# Altium project gps with esp32-c6.PrjPcb
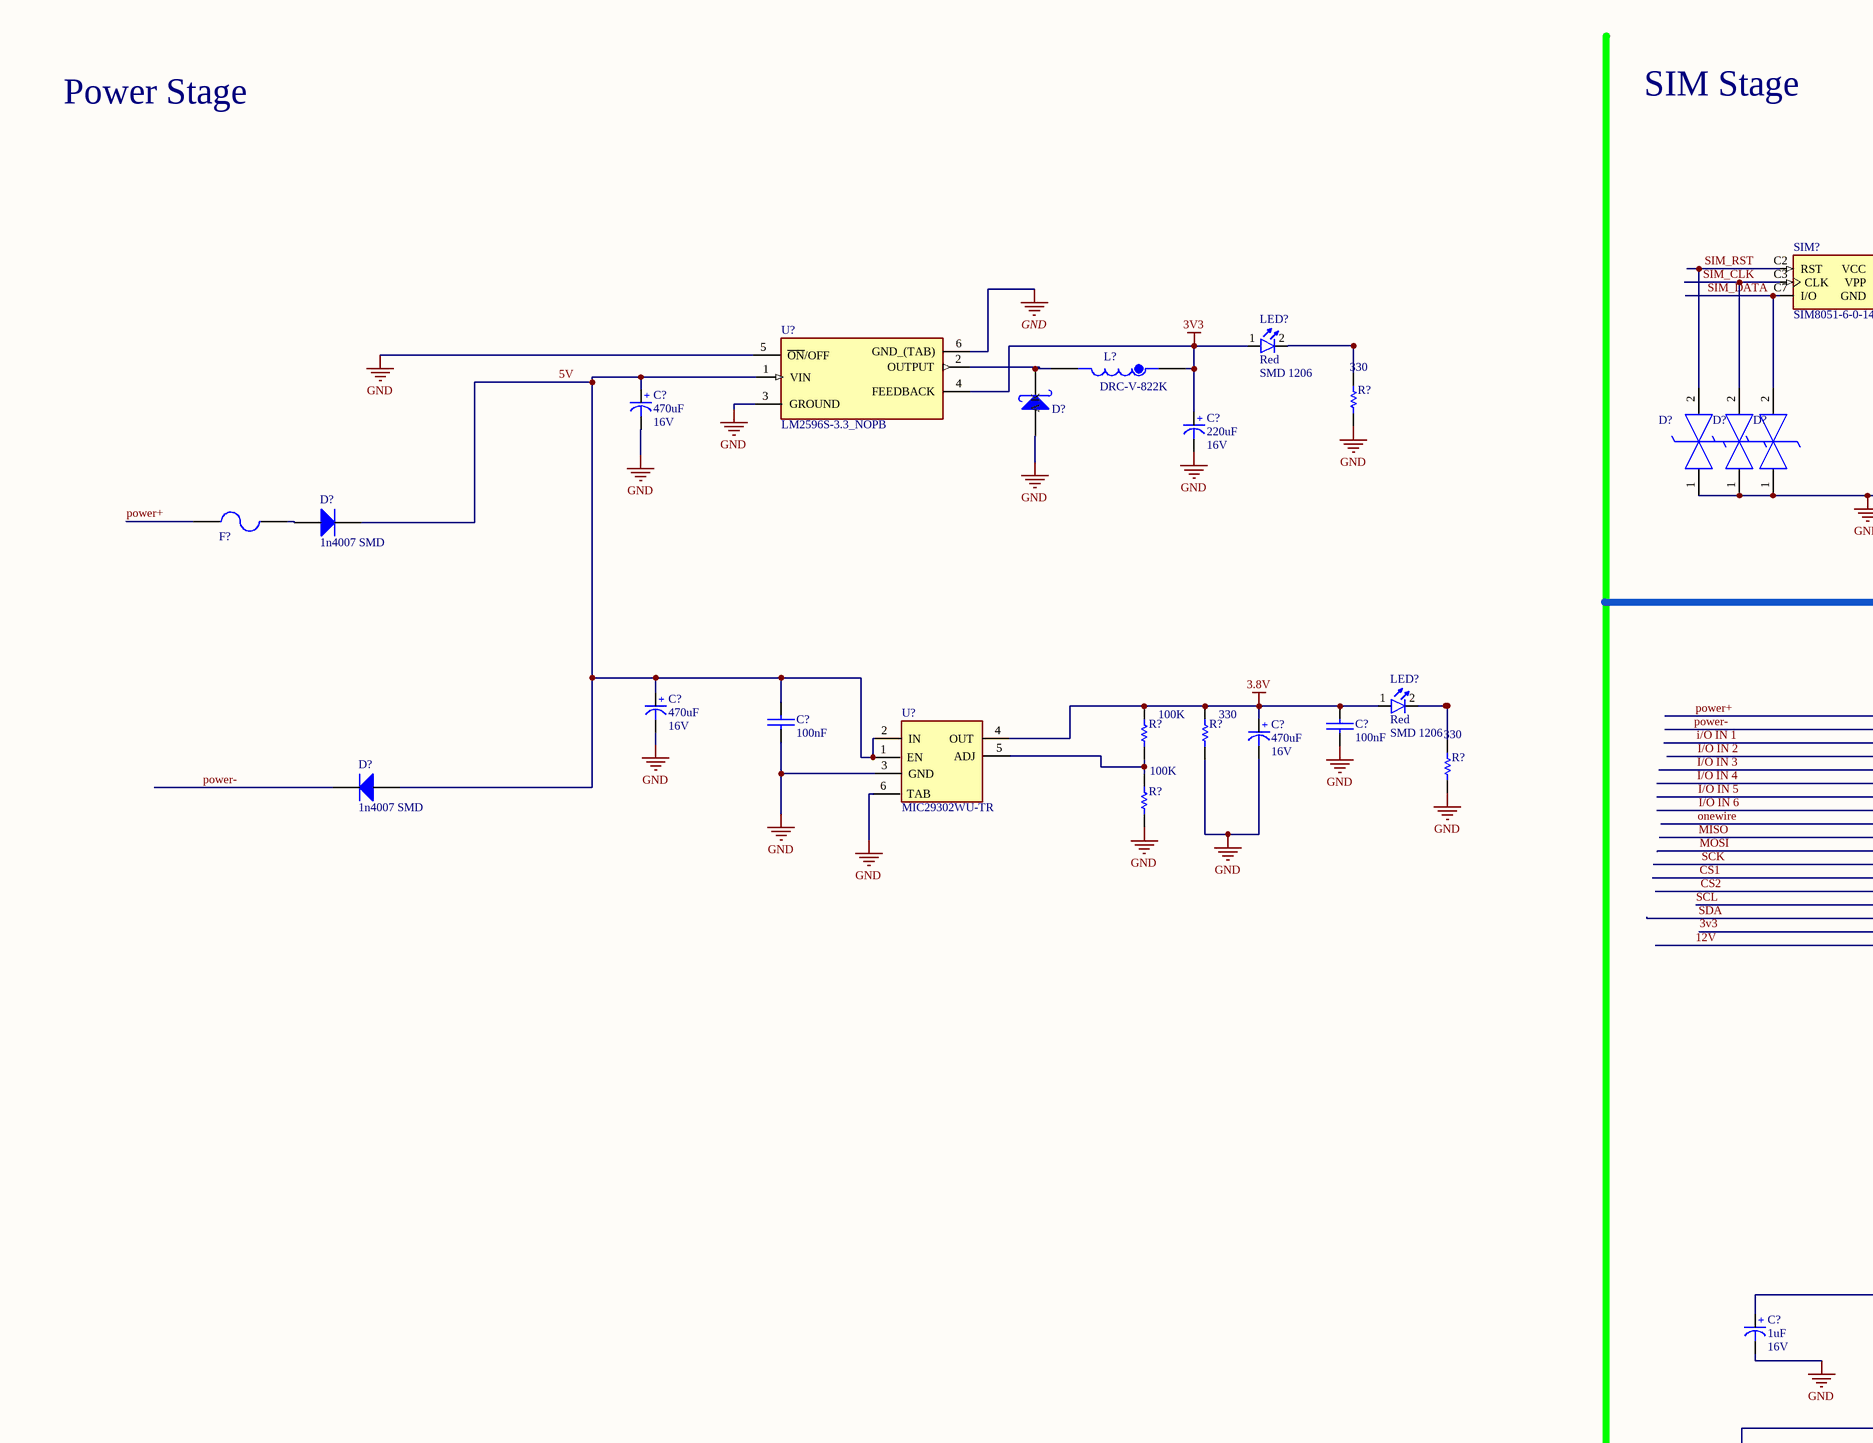
[diagram p0: main board.SchDoc, top left]
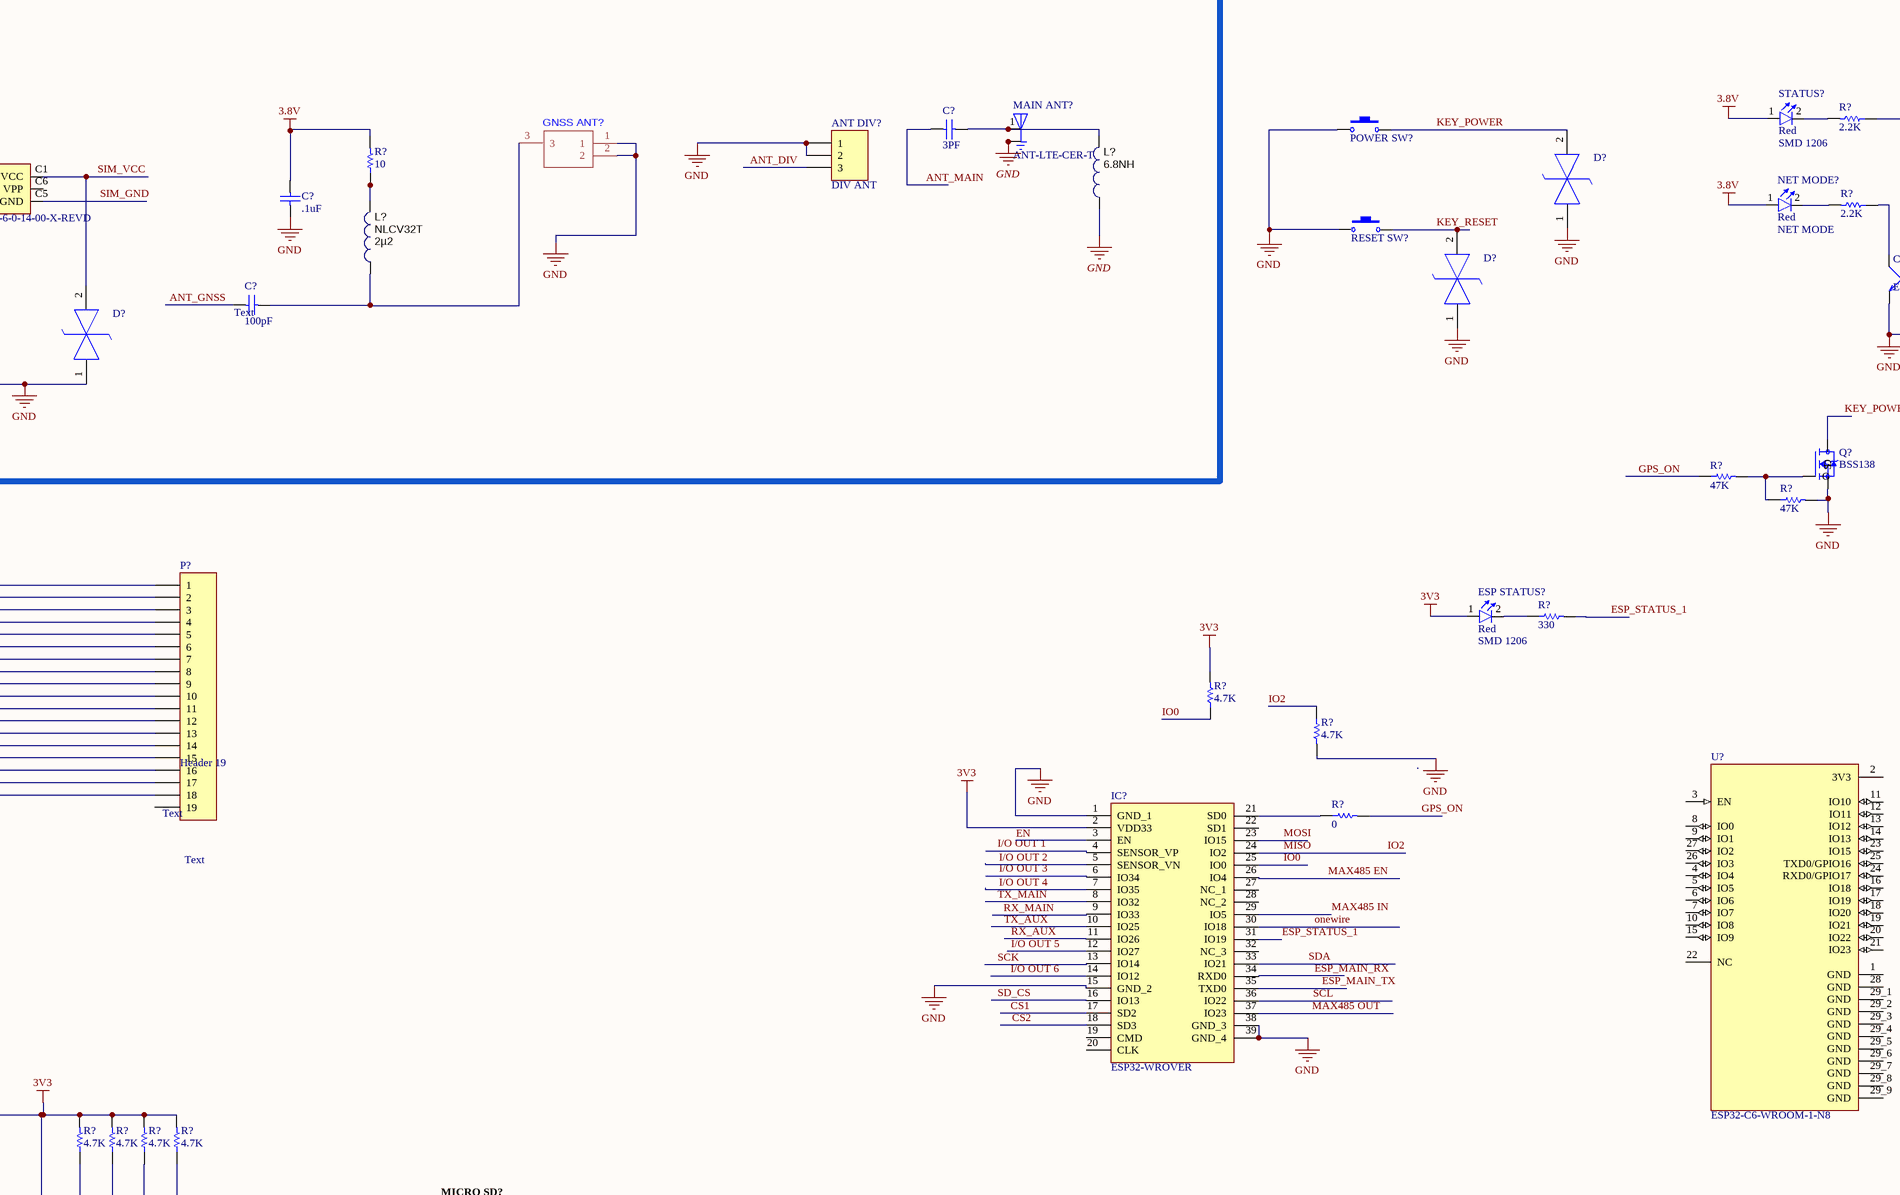
[diagram p1: main board.SchDoc, top middle]
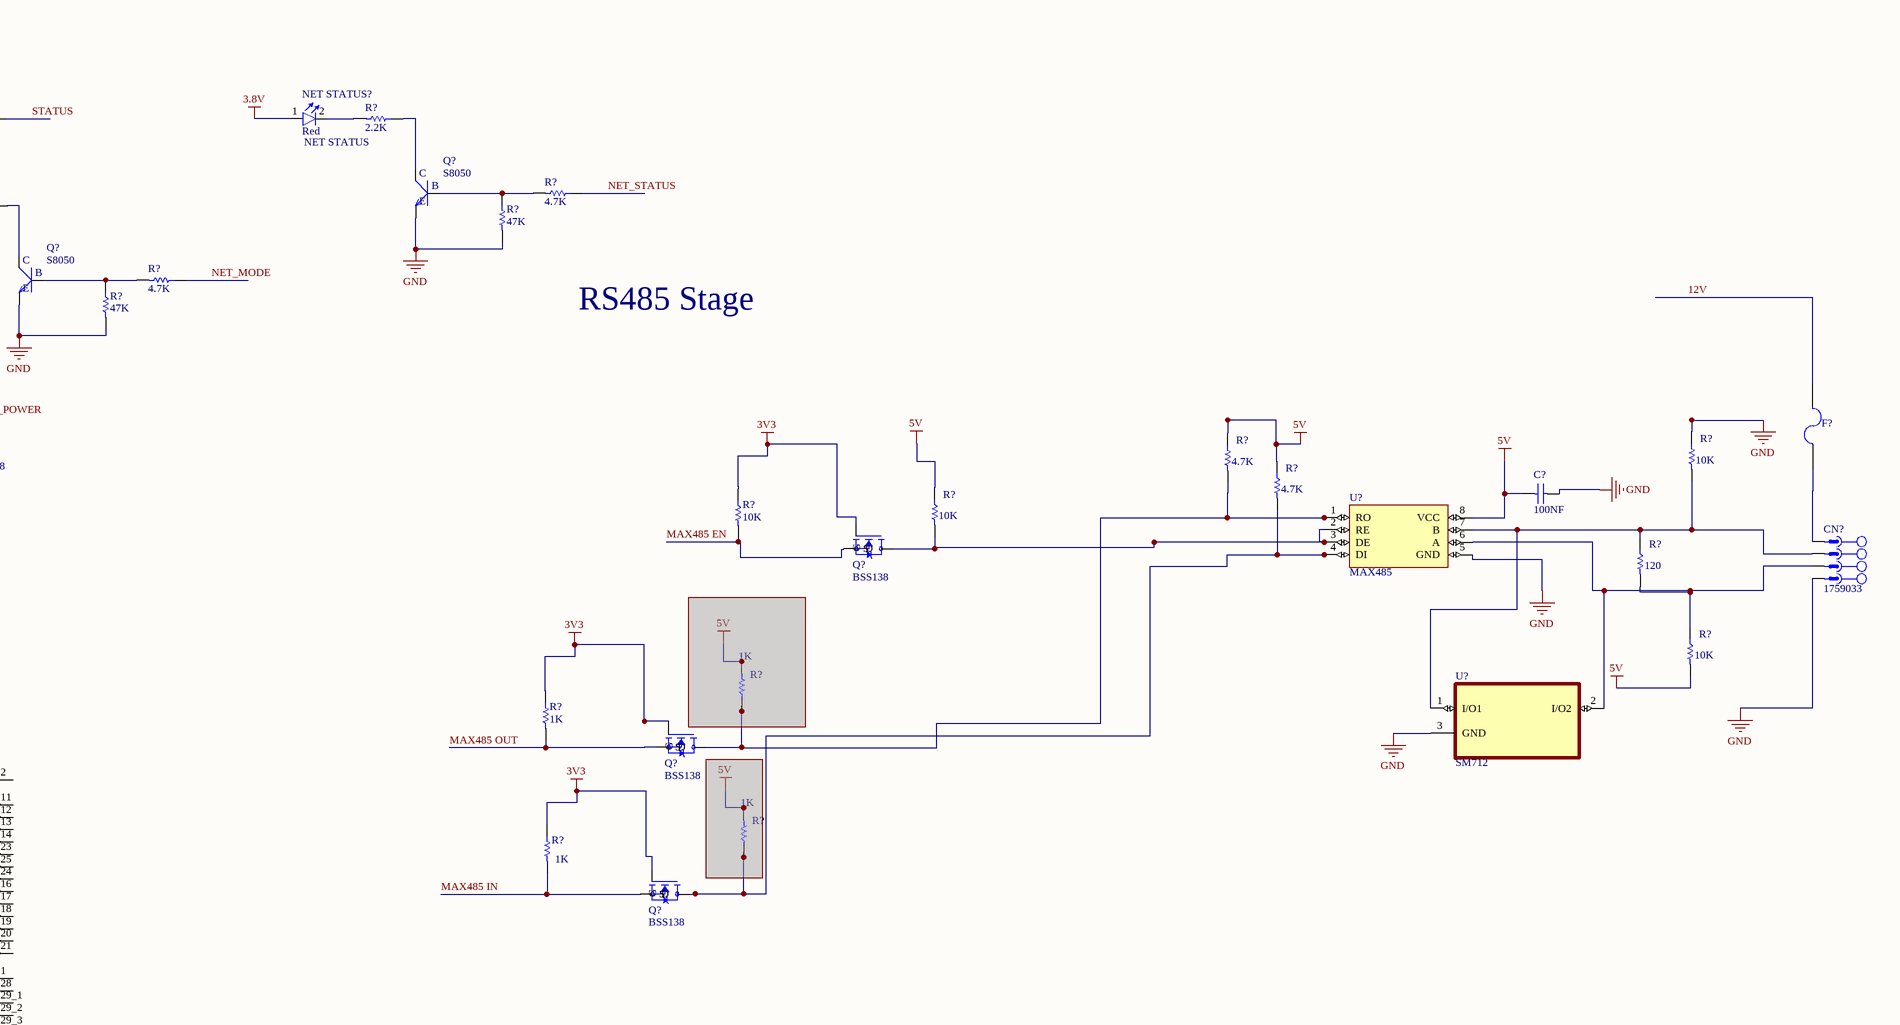
[diagram p2: main board.SchDoc, top right]
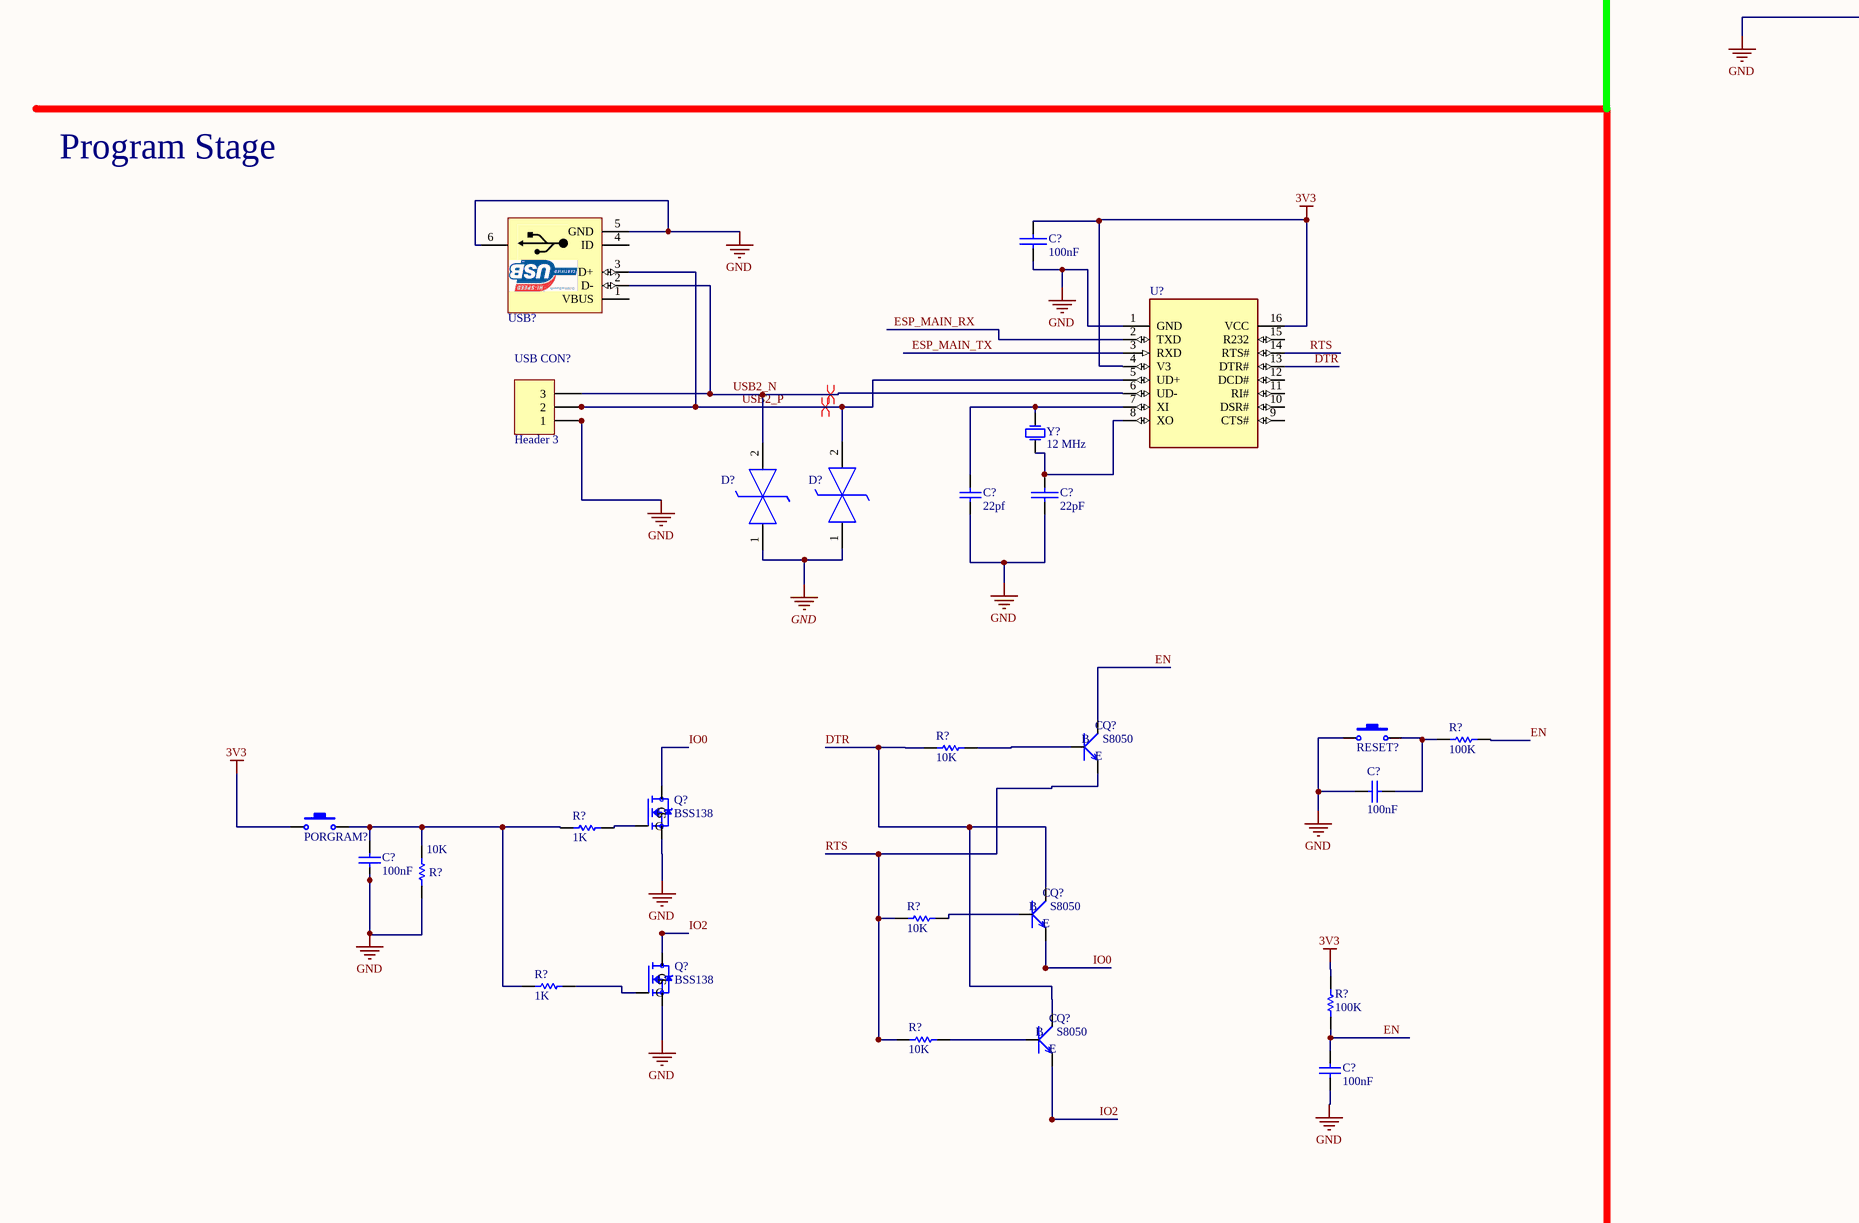
[diagram p3: main board.SchDoc, centre left]
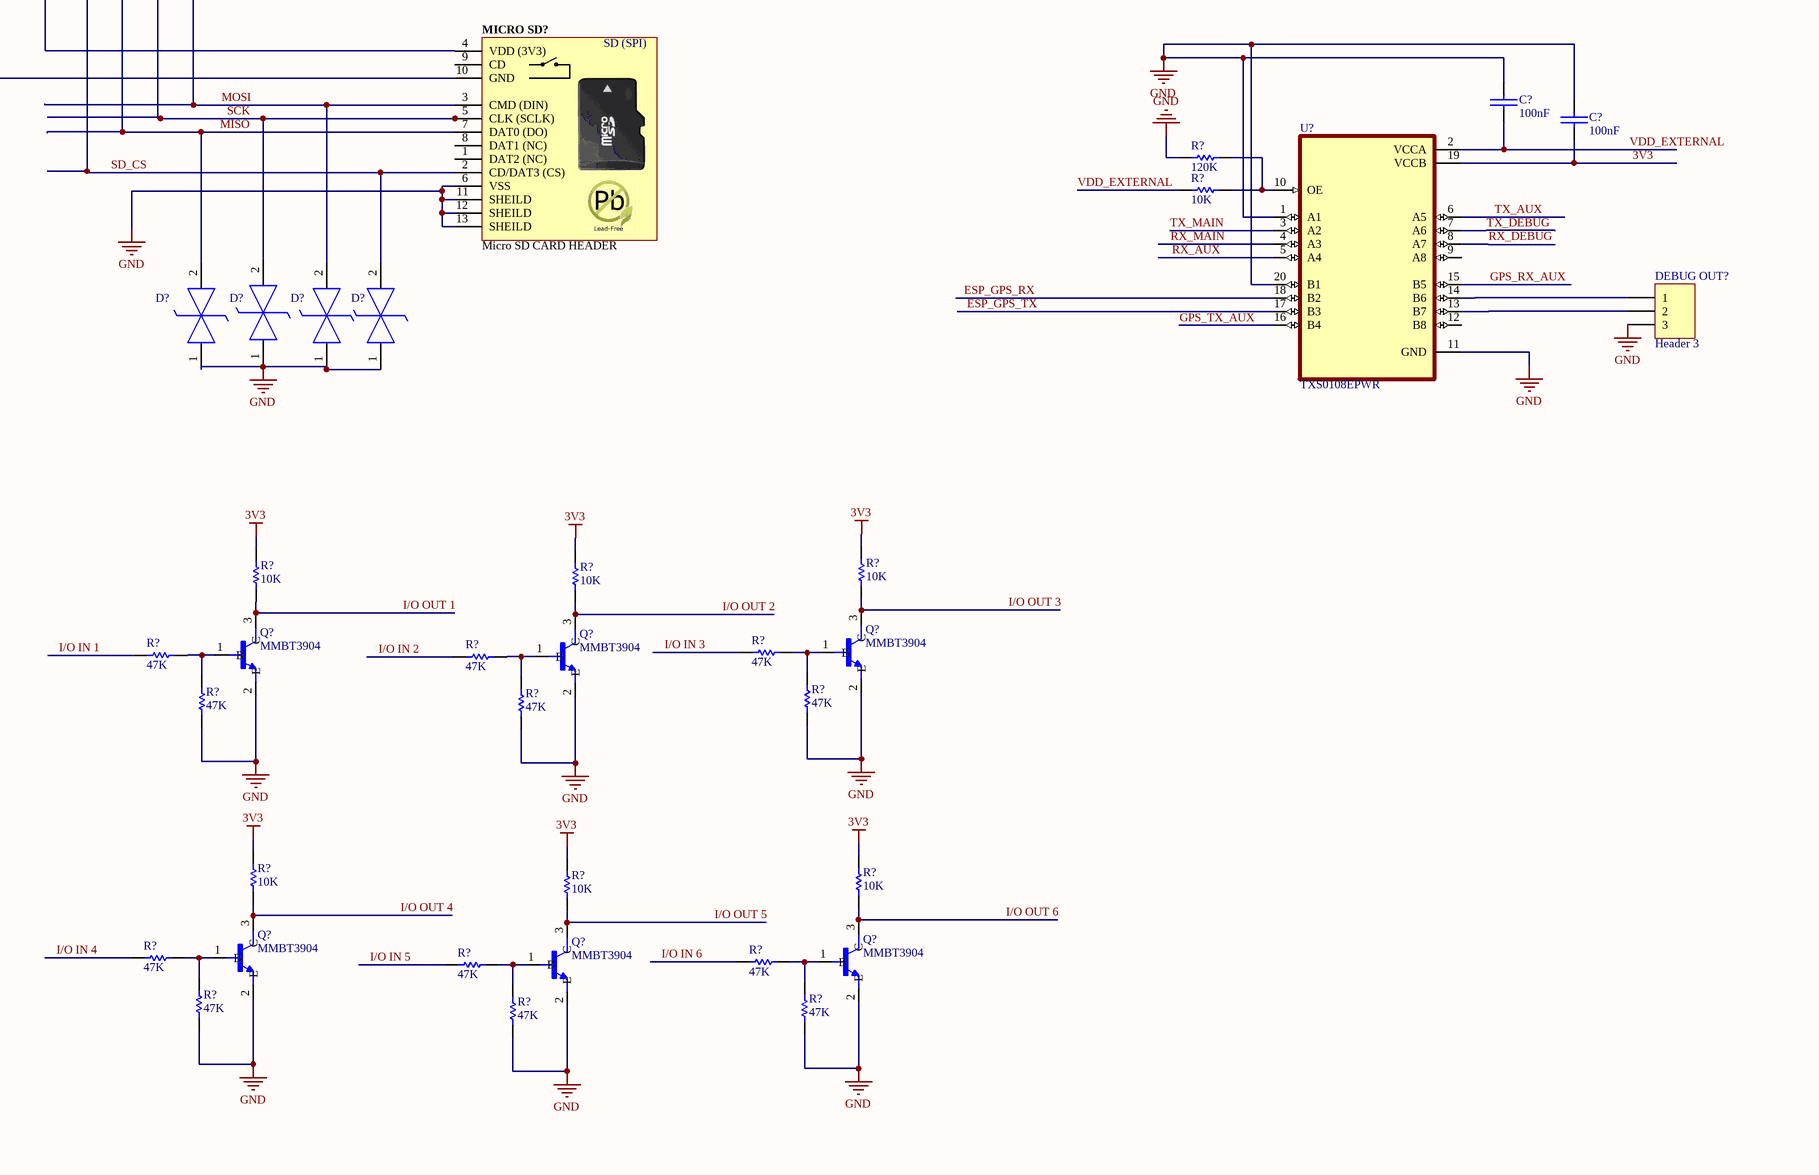
[diagram p4: main board.SchDoc, centre middle]
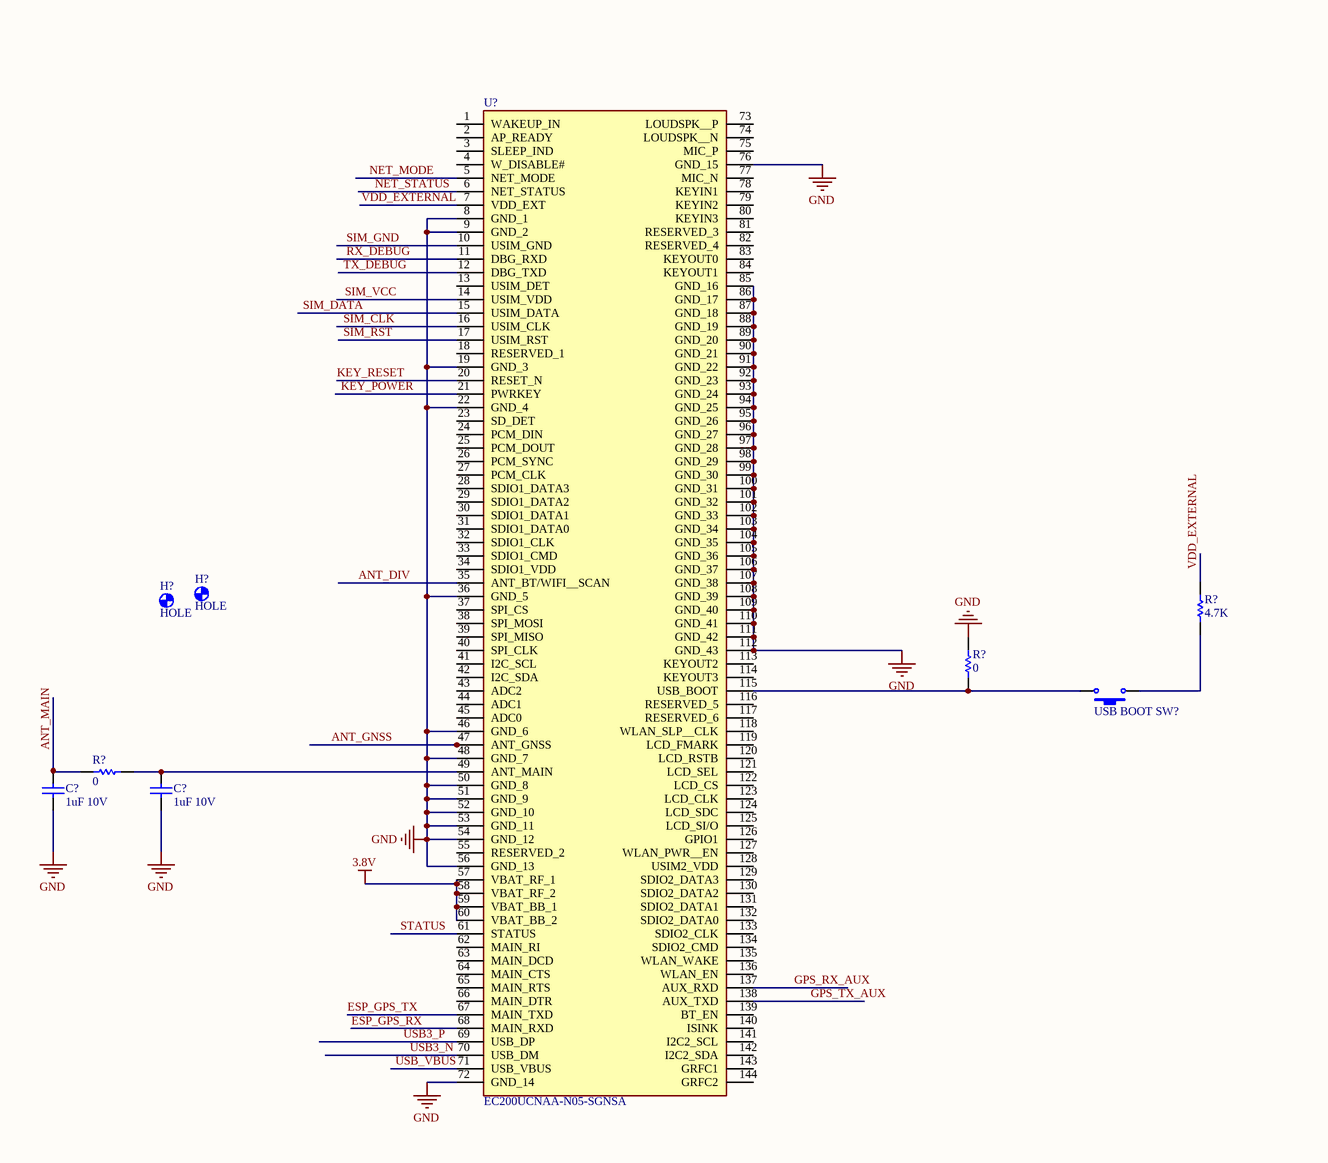
[diagram p5: main board.SchDoc, centre right]
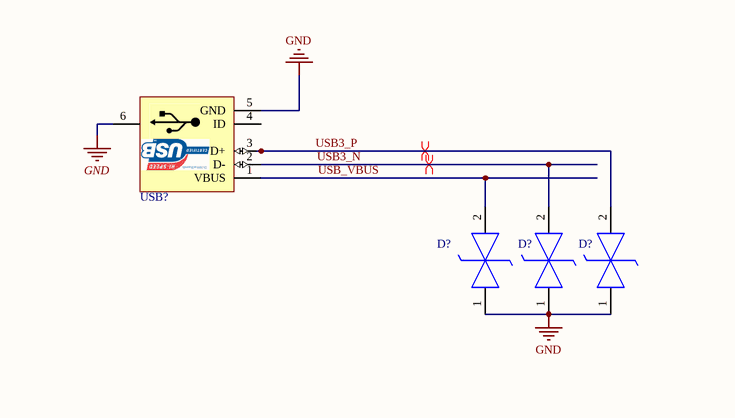
[diagram p6: main board.SchDoc, bottom middle]
1 sheet, 160 parts. Net scope: global (net labels, ports and power ports of the same name join across sheets).

## Sheet main board.SchDoc
size A0; SheetNumber: 1; SheetTotal: 1

### Parts
(Parts that share a designator on the sheet are numbered #1, #2 ... from top to bottom, then left to right.)
ANT_DIV?  DIV ANT  [HDR1X3]
C?#1  3PF  [CAPC2012X140N]
C?#2  .1uF  [CAPC2012X140N]
C?#3  Voltage: 16V  [CAP_EEEFN1C471P]  (hidden comment: 470uF)
C?#4  100pF  [CAPC2012X140N]
C?#5  Voltage: 16V  [CAP_EEEFT1C221AL]  (hidden comment: 220uF)
C?#6  100NF  [CAPC2012X140N]
C?#7  Voltage: 16V  [CAP_EEEFN1C471P]  (hidden comment: 470uF)
C?#8  100nF  [CAPC2012X140N]
C?#9  Voltage: 16V  [CAP_EEEFN1C471P]  (hidden comment: 470uF)
C?#10  100nF  [CAPC2012X140N]
C?#11  Voltage: 16V  [CAP_EEEFN1H100UR]  (hidden comment: 1uF)
C?#12  100nF  [CAPC2012X140N]
C?#13  100nF  [CAPC2012X140N]
C?#14  100nF  [CAPC2012X140N]
C?#15  22pf  [CAPC2012X140N]
C?#16  22pF  [CAPC2012X140N]
C?#17  100nF  [CAPC2012X140N]
C?#18  100nF  [CAPC2012X140N]
C?#19  100nF  [CAPC2012X140N]
C?#20  1uF 10V  [CAPC2012X140N]
C?#21  1uF 10V  [CAPC2012X140N]
CN?  1759033  [PCBComponent_1]
D?#1  PESD5V0S1BL,315  [DIO_PESD5V0S1UL,315]  (value not drawn)
D?#2  1n5822  [PCBComponent_1]  (value not drawn)
D?#3  PESD5V0S1BL,315  [DIO_PESD5V0S1UL,315]  (value not drawn)
D?#4  PESD5V0S1BL,315  [DIO_PESD5V0S1UL,315]  (value not drawn)
D?#5  PESD5V0S1BL,315  [DIO_PESD5V0S1UL,315]  (value not drawn)
D?#6  PESD5V0S1BL,315  [DIO_PESD5V0S1UL,315]  (value not drawn)
D?#7  PESD5V0S1BL,315  [DIO_PESD5V0S1UL,315]  (value not drawn)
D?#8  1n4007 SMD  [PCBComponent_1]
D?#9  1n4007 SMD  [PCBComponent_1]
D?#10  PESD5V0S1BL,315  [DIO_PESD5V0S1UL,315]  (value not drawn)
D?#11  PESD5V0S1BL,315  [DIO_PESD5V0S1UL,315]  (value not drawn)
D?#12  PESD5V0S1BL,315  [DIO_PESD5V0S1UL,315]  (value not drawn)
D?#13  PESD5V0S1BL,315  [DIO_PESD5V0S1UL,315]  (value not drawn)
D?#14  PESD5V0S1BL,315  [DIO_PESD5V0S1UL,315]  (value not drawn)
D?#15  PESD5V0S1BL,315  [DIO_PESD5V0S1UL,315]  (value not drawn)
D?#16  PESD5V0S1BL,315  [DIO_PESD5V0S1UL,315]  (value not drawn)
D?#17  PESD5V0S1BL,315  [DIO_PESD5V0S1UL,315]  (value not drawn)
D?#18  PESD5V0S1BL,315  [DIO_PESD5V0S1UL,315]  (value not drawn)
DEBUG_OUT?  Header 3  [TE_826926-3]
ESP_STATUS?  Size: SMD 1206  [PCBComponent_1]  (hidden comment: Red)
F?#1  F=1.0 A  [RESC3216X125N]  (value not drawn)
F?#2  F=4A  [RESC3216X125N]  (value not drawn)
GNSS_ANT?  U.FL-R-SMT-1_01_  [PCBComponent_1]  (value not drawn)
H?#1  HOLE  [P3.0]  (no BOM)
H?#2  HOLE  [P3.0]  (no BOM)
IC?  ESP32-WROVER  [XCVR_ESP32-WROVER-I]
L?#1  6.8NH  [INDM3225X240N]
L?#2  NLCV32T  value 2µ2  [INDM3225X240N]
L?#3  DRC-V-822K  [IND_DRC-V-821K]
LED?#1  Size: SMD 1206  [PCBComponent_1]  (hidden comment: Red)
LED?#2  Size: SMD 1206  [PCBComponent_1]  (hidden comment: Red)
MAIN_ANT?  ANT-LTE-CER-T  [XDCR_ANT-LTE-CER-T]
MICRO_SD?  Micro SD CARD HEADER  [AMPHENOL_GTFP08131Y2HR]
NET_MODE?  Size: NET MODE  [PCBComponent_1]  (hidden comment: Red)
NET_STATUS?  Size: NET STATUS  [PCBComponent_1]  (hidden comment: Red)
P?  Header 19  [HDR1X19]
PORGRAM?  Switch PB  [PCBComponent_1]  (value not drawn)
POWER_SW?  Switch PB  [PCBComponent_1]  (value not drawn)
Q?#1  S8050  [TRANS_SS8050-G]
Q?#2  S8050  [TRANS_SS8050-G]
Q?#3  BSS138  [SOT-23-3_L2.9-W1.3-P1.90-LS2.4-BR]
Q?#4  BSS138  [SOT-23-3_L2.9-W1.3-P1.90-LS2.4-BR]
Q?#5  BSS138  [SOT-23-3_L2.9-W1.3-P1.90-LS2.4-BR]
Q?#6  BSS138  [SOT-23-3_L2.9-W1.3-P1.90-LS2.4-BR]
Q?#7  MMBT3904  [SOT95P240X120-3N]
Q?#8  MMBT3904  [SOT95P240X120-3N]
Q?#9  MMBT3904  [SOT95P240X120-3N]
Q?#10  S8050  [TRANS_SS8050-G]
Q?#11  BSS138  [SOT-23-3_L2.9-W1.3-P1.90-LS2.4-BR]
Q?#12  MMBT3904  [SOT95P240X120-3N]
Q?#13  MMBT3904  [SOT95P240X120-3N]
Q?#14  MMBT3904  [SOT95P240X120-3N]
Q?#15  S8050  [TRANS_SS8050-G]
Q?#16  BSS138  [SOT-23-3_L2.9-W1.3-P1.90-LS2.4-BR]
Q?#17  S8050  [TRANS_SS8050-G]
R?#1  2.2K  [RESC2012X65N]
R?#2  2.2K  [RESC2012X65N]
R?#3  10  [RESC2012X65N]
R?#4  4.7K  [RESC2012X65N]
R?#5  2.2K  [RESC2012X65N]
R?#6  47K  [RESC2012X65N]
R?#7  4.7K  [RESC2012X65N]
R?#8  330  [RESC2012X65N]
R?#9  47K  [RESC2012X65N]
R?#10  4.7K  [RESC2012X65N]
R?#11  10K  [RESC2012X65N]
R?#12  47K  [RESC2012X65N]
R?#13  4.7K  [RESC2012X65N]
R?#14  47K  [RESC2012X65N]
R?#15  10K  [RESC2012X65N]
R?#16  10K  [RESC2012X65N]
R?#17  120  [RESC2012X65N]
R?#18  100K  [RESC2012X65N]
R?#19  330  [RESC2012X65N]
R?#20  330  [RESC2012X65N]
R?#21  330  [RESC2012X65N]
R?#22  10K  [RESC2012X65N]
R?#23  100K  [RESC2012X65N]
R?#24  1K  [1206]  (masked out: inside a compile mask, not in the netlist)
R?#25  4.7K  [RESC2012X65N]
R?#26  1K  [RESC2012X65N]
R?#27  4.7K  [RESC2012X65N]
R?#28  0  [RESC2012X65N]
R?#29  1K  [1206]  (masked out: inside a compile mask, not in the netlist)
R?#30  1K  [RESC2012X65N]
R?#31  4.7K  [RESC2012X65N]
R?#32  4.7K  [RESC2012X65N]
R?#33  4.7K  [RESC2012X65N]
R?#34  4.7K  [RESC2012X65N]
R?#35  120K  [RESC2012X65N]
R?#36  10K  [RESC2012X65N]
R?#37  10K  [RESC2012X65N]
R?#38  10K  [RESC2012X65N]
R?#39  10K  [RESC2012X65N]
R?#40  47K  [RESC2012X65N]
R?#41  47K  [RESC2012X65N]
R?#42  47K  [RESC2012X65N]
R?#43  47K  [RESC2012X65N]
R?#44  47K  [RESC2012X65N]
R?#45  47K  [RESC2012X65N]
R?#46  100K  [RESC2012X65N]
R?#47  10K  [RESC2012X65N]
R?#48  10K  [RESC2012X65N]
R?#49  10K  [RESC2012X65N]
R?#50  10K  [RESC2012X65N]
R?#51  1K  [RESC2012X65N]
R?#52  10K  [RESC2012X65N]
R?#53  47K  [RESC2012X65N]
R?#54  47K  [RESC2012X65N]
R?#55  47K  [RESC2012X65N]
R?#56  4.7K  [RESC2012X65N]
R?#57  10K  [RESC2012X65N]
R?#58  47K  [RESC2012X65N]
R?#59  47K  [RESC2012X65N]
R?#60  47K  [RESC2012X65N]
R?#61  0  [RESC2012X65N]
R?#62  1K  [RESC2012X65N]
R?#63  100K  [RESC2012X65N]
R?#64  10K  [RESC2012X65N]
R?#65  0  [RESC2012X65N]
RESET?  Switch PB  [PCBComponent_1]  (value not drawn)
RESET_SW?  Switch PB  [PCBComponent_1]  (value not drawn)
SIM?  SIM8051-6-0-14-00-X-REVD  [PCBComponent_1]
STATUS?  Size: SMD 1206  [PCBComponent_1]  (hidden comment: Red)
U?#1  LM2596S-3.3_NOPB  [TO170P1435X465-6N]
U?#2  MAX485  [SOIC127P600X175-8N]
U?#3  MIC29302WU-TR  [MIC29302WUTR]
U?#4  SM712  [SOT23]
U?#5  ESP32-C6-WROOM-1-N8  [XCVR_ESP32-C6-WROOM-1-N8]
U?#6  TXS0108EPWR  [SOP65P640X120-20N]
U?#7  (no value)  [SO16_M]
U?#8  EC200UCNAA-N05-SGNSA  [EC200UCNAAN05SGNSA]
USB?#1  USB Connector  [USB_AB_BM_SHS]  (value not drawn)
USB?#2  USB Connector  [USB_AB_BM_SHS]  (value not drawn)
USB_BOOT_SW?  Switch PB  [PCBComponent_1]  (value not drawn)
USB_CON?  Header 3  [HDR1X3]
Y?  12 MHz  [PCBComponent_1]

### Nets
3.8V: C?#2.2 C?#9.1(+) C?#10.2(-) LED?#2.1(A) NET_MODE?.1(A) NET_STATUS?.1(A) R?#3.2 R?#18.2 R?#19.2 STATUS?.1(A) U?#3.4(OUT) U?#8.57(VBAT_RF_1) U?#8.58(VBAT_RF_2) U?#8.59(VBAT_BB_1) U?#8.60(VBAT_BB_2)
3V3: C?#5.1(+) C?#11.1(+) C?#13.2(-) C?#14.2(-) ESP_STATUS?.1(A) IC?.2(VDD33) L?#3.1 LED?#1.1(A) MICRO_SD?.4(VDD_(3V3)) P?.17 PORGRAM?.1 Q?#4.1(G) Q?#5.1(G) Q?#6.1(G) R?#15.1 R?#25.2 R?#26.1 R?#30.1 R?#31.2 R?#32.2 R?#33.2 R?#34.2 R?#37.2 R?#38.2 R?#39.2 R?#48.2 R?#49.2 R?#50.2 R?#63.1 U?#1.4(FEEDBACK) U?#6.19(VCCB) U?#7.4(V3) U?#7.16(VCC)
5V: C?#3.1(+) C?#6.2 C?#7.1(+) C?#8.2(-) D?#8.2(K) D?#9.1(A) R?#10.1 R?#13.1 R?#16.1 R?#22.2 U?#1.1(VIN) U?#2.8(VCC) U?#3.1(EN) U?#3.2(IN)
GND: ANT_DIV?.1 ANT_DIV?.2 C?#2.1 C?#3.2(-) C?#5.2(-) C?#6.1 C?#7.2(-) C?#8.1(+) C?#9.2(-) C?#10.1(+) C?#11.2(-) C?#12.1(+) C?#13.1(+) C?#14.1(+) C?#15.2(-) C?#16.1(+) C?#17.1(+) C?#18.2(-) C?#19.2(-) C?#20.1 C?#21.1 CN?.4 D?#1.1(K1) D?#2.K D?#3.1(K1) D?#4.1(K1) D?#5.1(K1) D?#6.1(K1) D?#7.1(K1) D?#10.1(K1) D?#11.1(K1) D?#12.1(K1) D?#13.1(K1) D?#14.1(K1) D?#15.1(K1) D?#16.1(K1) D?#17.1(K1) D?#18.1(K1) DEBUG_OUT?.3 GNSS_ANT?.1 GNSS_ANT?.2 IC?.1(GND_1) IC?.15(GND_2) IC?.38(GND_3) IC?.39(GND_4) L?#1.1 MAIN_ANT?.2(GND) MAIN_ANT?.3(GND) MICRO_SD?.6(VSS) MICRO_SD?.10(GND) MICRO_SD?.11(SHEILD) MICRO_SD?.12(SHEILD) MICRO_SD?.13(SHEILD) POWER_SW?.1 Q?#1.2(E) Q?#2.2(E) Q?#3.2(S) Q?#7.2(E) Q?#8.2(E) Q?#9.2(E) Q?#11.2(S) Q?#12.2(E) Q?#13.2(E) Q?#14.2(E) Q?#16.2(S) R?#6.2 R?#8.1 R?#9.2 R?#11.1 R?#14.2 R?#19.1 R?#21.1 R?#23.1 R?#27.2 R?#35.2 R?#43.1 R?#44.1 R?#45.1 R?#52.1 R?#58.1 R?#59.1 R?#60.1 R?#61.1 RESET?.1 RESET_SW?.1 U?#1.3(GROUND) U?#1.5(~{ON}/OFF) U?#1.6(GND_(TAB)) U?#2.5(GND) U?#3.3(GND) U?#3.6(TAB) U?#4.3(GND) U?#6.1(A1) U?#6.11(GND) U?#6.20(B1) U?#7.1(GND) U?#8.8(GND_1) U?#8.9(GND_2) U?#8.19(GND_3) U?#8.22(GND_4) U?#8.36(GND_5) U?#8.46(GND_6) U?#8.48(GND_7) U?#8.50(GND_8) U?#8.51(GND_9) U?#8.52(GND_10) U?#8.53(GND_11) U?#8.54(GND_12) U?#8.56(GND_13) U?#8.72(GND_14) U?#8.76(GND_15) U?#8.85(GND_16) U?#8.86(GND_17) U?#8.87(GND_18) U?#8.88(GND_19) U?#8.89(GND_20) U?#8.90(GND_21) U?#8.91(GND_22) U?#8.92(GND_23) U?#8.93(GND_24) U?#8.94(GND_25) U?#8.95(GND_26) U?#8.96(GND_27) U?#8.97(GND_28) U?#8.98(GND_29) U?#8.99(GND_30) U?#8.100(GND_31) U?#8.101(GND_32) U?#8.102(GND_33) U?#8.103(GND_34) U?#8.104(GND_35) U?#8.105(GND_36) U?#8.106(GND_37) U?#8.107(GND_38) U?#8.108(GND_39) U?#8.109(GND_40) U?#8.110(GND_41) U?#8.111(GND_42) U?#8.112(GND_43) USB?#1.5(GND) USB?#1.6(MH) USB?#2.5(GND) USB?#2.6(MH) USB_CON?.1
12V: F?#2.2 P?.18
ANT_DIV: ANT_DIV?.3 U?#8.35(ANT_BT/WIFI__SCAN)
ANT_GNSS: C?#4.1 U?#8.47(ANT_GNSS)
ANT_MAIN: C?#1.2 C?#20.2 R?#65.1
CS1: IC?.17(SD2) P?.13
CS2: IC?.18(SD3) P?.14
DTR: Q?#15.3(C) Q?#17.3(C) R?#47.2 U?#7.13(DTR#)
EN: C?#19.1(+) IC?.3(EN) Q?#10.3(C) R?#46.1 R?#63.2
ESP_GPS_RX: U?#6.18(B2) U?#8.68(MAIN_RXD)
ESP_GPS_TX: U?#6.17(B3) U?#8.67(MAIN_TXD)
ESP_MAIN_RX: IC?.34(RXD0) U?#7.2(TXD)
ESP_MAIN_TX: IC?.35(TXD0) U?#7.3(RXD)
ESP_STATUS_1: IC?.31(IO19) R?#20.2
GPS_ON: R?#12.1 R?#28.2
GPS_RX_AUX: U?#6.15(B5) U?#8.137(AUX_RXD)
GPS_TX_AUX: U?#6.16(B4) U?#8.138(AUX_TXD)
I/O IN 1: P?.3 R?#40.2
I/O IN 2: P?.4 R?#41.2
I/O IN 3: P?.5 R?#42.2
I/O IN 4: P?.6 R?#53.2
I/O IN 5: P?.7 R?#54.2
I/O IN 6: P?.8 R?#55.2
I/O OUT 1: IC?.4(SENSOR_VP) Q?#7.3(C) R?#37.1
I/O OUT 2: IC?.5(SENSOR_VN) Q?#8.3(C) R?#38.1
I/O OUT 3: IC?.6(IO34) Q?#9.3(C) R?#39.1
I/O OUT 4: IC?.7(IO35) Q?#12.3(C) R?#48.1
I/O OUT 5: IC?.12(IO27) Q?#13.3(C) R?#49.1
I/O OUT 6: IC?.14(IO12) Q?#14.3(C) R?#50.1
IO0: IC?.25(IO0) Q?#11.3(D) Q?#15.2(E) R?#25.1
IO2: D?#11.2(K2) IC?.24(IO2) MICRO_SD?.7(DAT0_(DO)) P?.10 Q?#16.3(D) Q?#17.2(E) R?#27.1 R?#32.1  [also labelled MISO]
KEY_POWER: D?#1.2(K2) POWER_SW?.2 Q?#3.3(D) U?#8.21(PWRKEY)
KEY_RESET: D?#3.2(K2) RESET_SW?.2 U?#8.20(RESET_N)
MAX485 EN: IC?.26(IO4) Q?#4.2(S) R?#15.2
MAX485 IN: IC?.29(IO5) Q?#6.2(S) R?#30.2
MAX485 OUT: IC?.37(IO23) Q?#5.2(S) R?#26.2
MOSI: D?#12.2(K2) IC?.23(IO15) MICRO_SD?.3(CMD_(DIN)) P?.11 R?#34.1
NET_MODE: R?#7.1 U?#8.5(NET_MODE)
NET_STATUS: R?#4.1 U?#8.6(NET_STATUS)
onewire: IC?.30(IO18) P?.9
power+: F?#1.1 P?.1
power-: D?#9.2(K) P?.2
RTS: Q?#10.2(E) R?#57.2 R?#64.2 U?#7.14(RTS#)
RX_AUX: IC?.11(IO26) U?#6.5(A4)
RX_DEBUG: U?#6.8(A7) U?#8.11(DBG_RXD)
RX_MAIN: IC?.9(IO33) U?#6.4(A3)
SCK: D?#10.2(K2) IC?.13(IO14) MICRO_SD?.5(CLK_(SCLK)) P?.12 R?#33.1
SCL: IC?.36(IO22) P?.15
SD_CS: D?#13.2(K2) IC?.16(IO13) MICRO_SD?.2(CD/DAT3_(CS)) R?#31.1
SDA: IC?.33(IO21) P?.16
SIM_CLK: D?#5.2(K2) SIM?.C3(CLK) U?#8.16(USIM_CLK)
SIM_DATA: D?#6.2(K2) SIM?.C7(I/O) U?#8.15(USIM_DATA)
SIM_GND: SIM?.C5(GND) U?#8.10(USIM_GND)
SIM_RST: D?#4.2(K2) SIM?.C2(RST) U?#8.17(USIM_RST)
SIM_VCC: D?#7.2(K2) SIM?.C1(VCC) U?#8.14(USIM_VDD)
STATUS: R?#1.1 U?#8.61(STATUS)
TX_AUX: IC?.10(IO25) U?#6.6(A5)
TX_DEBUG: U?#6.7(A6) U?#8.12(DBG_TXD)
TX_MAIN: IC?.8(IO32) U?#6.3(A2)
USB2_N: D?#15.2(K2) U?#7.6(UD-) USB?#1.2(D-) USB_CON?.3
USB2_P: D?#14.2(K2) U?#7.5(UD+) USB?#1.3(D+) USB_CON?.2
USB3_N: D?#17.2(K2) U?#8.70(USB_DM) USB?#2.2(D-)
USB3_P: D?#18.2(K2) U?#8.69(USB_DP) USB?#2.3(D+)
USB_VBUS: D?#16.2(K2) U?#8.71(USB_VBUS) USB?#2.1(VBUS)
VDD_EXTERNAL: C?#12.2(-) R?#36.2 R?#56.1 U?#6.2(VCCA) U?#8.7(VDD_EXT)
NetC?#1_1: C?#1.1 L?#1.2 MAIN_ANT?.1(FEEDING)
NetC?#4_2: C?#4.2 GNSS_ANT?.3 L?#2.1
NetC?#15_1: C?#15.1(+) U?#7.7(XI) Y?.2(OSC2)
NetC?#16_2: C?#16.2(-) U?#7.8(XO) Y?.1(OSC1)
NetC?#17_2: C?#17.2(-) R?#46.2 RESET?.2
NetC?#18_1: C?#18.1(+) PORGRAM?.2 R?#51.2 R?#52.2 R?#62.2
NetC?#21_2: C?#21.2 R?#65.2 U?#8.49(ANT_MAIN)
NetCN?_1: CN?.1 F?#2.1
NetCN?_2: CN?.2 R?#11.2 R?#17.1 U?#2.7(B) U?#4.1(I/O1)
NetCN?_3: CN?.3 R?#17.2 R?#22.1 U?#2.6(A) U?#4.2(I/O2)
NetD?#2_A: D?#2.A L?#3.2 U?#1.2(OUTPUT)
NetD?#8_1: D?#8.1(A) F?#1.2
NetDEBUG_OUT?_1: DEBUG_OUT?.1 U?#6.14(B6)
NetDEBUG_OUT?_2: DEBUG_OUT?.2 U?#6.13(B7)
NetESP_STATUS?_2: ESP_STATUS?.2(K) R?#20.1
NetIC?_21: IC?.21(SD0) R?#28.1
NetL?#2_2: L?#2.2 R?#3.1
NetLED?#1_2: LED?#1.2(K) R?#8.2
NetLED?#2_2: LED?#2.2(K) R?#21.2
NetNET_MODE?_2: NET_MODE?.2(K) R?#5.2
NetNET_STATUS?_2: NET_STATUS?.2(K) R?#2.2
NetQ?#1_1: Q?#1.1(B) R?#4.2 R?#6.1
NetQ?#1_3: Q?#1.3(C) R?#2.1
NetQ?#2_1: Q?#2.1(B) R?#7.2 R?#9.1
NetQ?#2_3: Q?#2.3(C) R?#5.1
NetQ?#3_1: Q?#3.1(G) R?#12.2 R?#14.1
NetQ?#4_3: Q?#4.3(D) R?#16.2 U?#2.2(RE) U?#2.3(DE)
NetQ?#5_3: Q?#5.3(D) R?#10.2 U?#2.1(RO)
NetQ?#6_3: Q?#6.3(D) R?#13.2 U?#2.4(DI)
NetQ?#7_1: Q?#7.1(B) R?#40.1 R?#43.2
NetQ?#8_1: Q?#8.1(B) R?#41.1 R?#44.2
NetQ?#9_1: Q?#9.1(B) R?#42.1 R?#45.2
NetQ?#10_1: Q?#10.1(B) R?#47.1
NetQ?#11_1: Q?#11.1(G) R?#51.1
NetQ?#12_1: Q?#12.1(B) R?#53.1 R?#58.2
NetQ?#13_1: Q?#13.1(B) R?#54.1 R?#60.2
NetQ?#14_1: Q?#14.1(B) R?#55.1 R?#59.2
NetQ?#15_1: Q?#15.1(B) R?#57.1
NetQ?#16_1: Q?#16.1(G) R?#62.1
NetQ?#17_1: Q?#17.1(B) R?#64.1
NetR?#1_2: R?#1.2 STATUS?.2(K)
NetR?#18_1: R?#18.1 R?#23.2 U?#3.5(ADJ)
NetR?#35_1: R?#35.1 R?#36.1 U?#6.10(OE)
NetR?#56_2: R?#56.2 USB_BOOT_SW?.1
NetR?#61_2: R?#61.2 U?#8.115(USB_BOOT) USB_BOOT_SW?.2

Not connected (* = marked no-connect by the designer): IC? 19(CMD) 20(CLK) 22(SD1) 27(NC_1) 28(NC_2) 32(NC_3); MICRO_SD? 1(DAT2_(NC)) 8(DAT1_(NC)) 9(CD); P? 19; SIM? C6(VPP); U?#5 1(GND) 2(3V3) 3(EN) 4(IO4) 5(IO5) 6(IO6) 7(IO7) 8(IO0) 9(IO1) 10(IO8) 11(IO10) 12(IO11) 13(IO12) 14(IO13) 15(IO9) 16(IO18) 17(IO19) 18(IO20) 19(IO21) 20(IO22) 21(IO23) 22(NC) 23(IO15) 24(RXD0/GPIO17) 25(TXD0/GPIO16) 26(IO3) 27(IO2) 28(GND) 29_1(GND) 29_2(GND) 29_3(GND) 29_4(GND) 29_5(GND) 29_6(GND) 29_7(GND) 29_8(GND) 29_9(GND); U?#6 9(A8) 12(B8); U?#7 9(CTS#) 10(DSR#) 11(RI#) 12(DCD#) 15(R232); U?#8 1(WAKEUP_IN) 2(AP_READY) 3(SLEEP_IND) 4(W_DISABLE#) 13(USIM_DET) 18(RESERVED_1) 23(SD_DET) 24(PCM_DIN) 25(PCM_DOUT) 26(PCM_SYNC) 27(PCM_CLK) 28(SDIO1_DATA3) 29(SDIO1_DATA2) 30(SDIO1_DATA1) 31(SDIO1_DATA0) 32(SDIO1_CLK) 33(SDIO1_CMD) 34(SDIO1_VDD) 37(SPI_CS) 38(SPI_MOSI) 39(SPI_MISO) 40(SPI_CLK) 41(I2C_SCL) 42(I2C_SDA) 43(ADC2) 44(ADC1) 45(ADC0) 55(RESERVED_2) 62(MAIN_RI) 63(MAIN_DCD) 64(MAIN_CTS) 65(MAIN_RTS) 66(MAIN_DTR) 73(LOUDSPK__P) 74(LOUDSPK__N) 75(MIC_P) 77(MIC_N) 78(KEYIN1) 79(KEYIN2) 80(KEYIN3) 81(RESERVED_3) 82(RESERVED_4) 83(KEYOUT0) 84(KEYOUT1) 113(KEYOUT2) 114(KEYOUT3) 116(RESERVED_5) 117(RESERVED_6) 118(WLAN_SLP__CLK) 119(LCD_FMARK) 120(LCD_RSTB) 121(LCD_SEL) 122(LCD_CS) 123(LCD_CLK) 124(LCD_SDC) 125(LCD_SI/O) 126(GPIO1) 127(WLAN_PWR__EN) 128(USIM2_VDD) 129(SDIO2_DATA3) 130(SDIO2_DATA2) 131(SDIO2_DATA1) 132(SDIO2_DATA0) 133(SDIO2_CLK) 134(SDIO2_CMD) 135(WLAN_WAKE) 136(WLAN_EN) 139(BT_EN) 140(ISINK) 141(I2C2_SCL) 142(I2C2_SDA) 143(GRFC1) 144(GRFC2); USB?#1 1(VBUS) 4(ID); USB?#2 4(ID)

### Layout directives
differential pair: USB2_N, USB2_P, USB3_N, USB3_P

### Notes on the sheet
- Power Stage
- SIM Stage
- (near C?#4) Text
- RS485 Stage
- (near P?) Text
- Program Stage
- (in symbol CON_Micro SD) SD (SPI)
- (in symbol USB AB MICRO CONNECTOR) D:AbbasBasereh

### Library data of the parts
ANT_DIV? DEBUG_OUT? USB_CON? = Header 3: Header, 3-Pin; LatestRevisionDate: 17-Jul-2002; LatestRevisionNote: Re-released for DXP Platform.; Publisher: Altium Limited
C?#1 C?#2 C?#4 C?#6 = CAP SMD 1206: CAP 1206; Designer: Abbas Basereh; Desc.: CAP SMD 1206; Data: 16-12-2016
C?#3 C?#5 C?#7 C?#9 C?#11 = Cap-Polar: Polar Capacitor; Designer: Saeid Jorablo; Organazation: ControTec; Adding Date: 1387/12/20
  C?#3 C?#7 C?#9: Value: 470uF
  C?#5: Value: 220uF
  C?#11: Value: 1uF
C?#8 C?#10 C?#12-C?#14 C?#16 = Cap-Bipolar: Bipolar Capacitor; Voltage: 100V; Designer: Saeid Jorablo; Organazation: ControTec; Adding Date: 1387/12/20
  C?#8 C?#10 C?#12-C?#14: Value: 100nF
  C?#16: Value: 22pF
C?#15 C?#17-C?#19 = CAP_Bipolar: Bipolar Capacitor; Voltage: 100V; Designer: Eng. Saeid Jorablo; Company: SJ Libraries; ComponentLink1Description: Datasheet; ComponentLink2Description: Reference; Publisher: SJ Unlimited; Mounting Technology: *; Mounting Technology: Surface Mount\Through-Hole; HelpURL: http://s3.picofile.com/file/7443264187/Coming_Soon_logo.gif; Status: Unreleased
  C?#15: Value: 22pf
  C?#17-C?#19: Value: 100nF
C?#20 C?#21 = CAP SMD 1206: 10 V; Designer: Abbas Basereh; Desc.: CAP SMD 1206; Data: 16-12-2016
CN? = CON_Phoenix_MSTB_04: 4 Pitch: 5.08 mm Color: green Contact surface: Tin Assembly; Manufacturer: PHOENIX CONTACT; Connector type: PCB Terminal Block; designer: ABBAS BASEREH; Max Current: 12 A; Positions: 4; Voltage: 320 V; Category: Connector; ComponentLink1Description: Header, Nominal current: 12 A Rated voltage (III/2): 320 V Number of positions: 4 Pitch: 5.08 mm Color: green Contact surface: Tin Assembly: Soldering  DESIGNER:ABBAS BASEREH; ComponentLink2Description: Reference; Mounting Technology: Through-Hole; Pin Count: 4; Revision 1: 2017-3-1; Status: Unreleased; PART.NO: 1759033
D?#1 D?#3-D?#7 D?#10-D?#18 = PESD5V0S1BL,315: Diode ESD (Bi-directional); Manufacturer_Name: Nexperia; Datasheet Link: https://assets.nexperia.com/documents/data-sheet/PESD5V0S1BL.pdf; Height: 0mm; Manufacturer_Part_Number: PESD5V0S1BL,315; Mouser Part Number: 771-PESD5V0S1BL315; Mouser Price/Stock: https://www.mouser.co.uk/ProductDetail/Nexperia/PESD5V0S1BL315?qs=LOCUfHb8d9vNKhGKXkjrvQ%3D%3D; Arrow Part Number: PESD5V0S1BL,315; Arrow Price/Stock: https://www.arrow.com/en/products/pesd5v0s1bl315/nexperia
D?#2 = 1n5822 SMD: Schottky Rectifiers; Part. No: SS34; Manufacturer: ON Semiconductor/Fairchild; Designer: Abbas Basereh; Link: https://www.aliexpress.com/item/Free-shipping-100pcs-1n5822-sma-smd-do-214ac-Schottky-diode-ss34/32337482329.html?spm=2114.01010208.3.1.zLZDsP&ws_ab_test=searchweb0_0,searchweb201602_4_10065_10068_10084_10083_10080_10082_10081_10060_10061_10062_10056_10055_10054_10059_10099_10078_10079_427_10073_10103_10102_10096_10052_10050_10051,searchweb201603_4&btsid=6e50dc92-ac69-45bc-a19e-209af19ce602; Link: http://www.tme.eu/en/details/ss34/smd-schottky-diodes/vishay/ss34-e357t/; Link: http://www.digikey.com/product-detail/en/on-semiconductor-fairchild/SS34/SS34FSCT-ND/2094459; Data: 16-12-2016
D?#8 D?#9 = DIODE_BYW98: HIGH EFFICIENCY FAST RECOVERY RECTIFIER DIODES; Designer: Eng. Saeid Jorablo; Company: SJ Libraries; IF(av): 3 A; Vrrm: 200 V; Trr (max): 35 ns; ComponentLink1Description: Datasheet; ComponentLink2Description: Reference; Publisher: SJ Unlimited; Mounting Technology: Surface Mount\Through-Hole; HelpURL: http://s3.picofile.com/file/7443264187/Coming_Soon_logo.gif; Status: Unreleased
ESP_STATUS? LED?#1 LED?#2 NET_MODE? NET_STATUS? STATUS? = LED: 5V OK; Designer: Saeid Jorablo; Organazation: ControTec; Adding Date: 1387/12/22; Color: Red
F?#1 F?#2 = Fuse 5x20 with holdeer pins: Fuses 5x20; Designer: Abbas Basereh; Desc.: fuse with holder pins 5x20; Data: 28-12-2016
H?#1 H?#2 = MOUNT-HOLE: MOUNTING HOLE with drill center marker
IC? = ESP32-WROVER: Integrated Circuit; Manufacturer_Name: Espressif Systems; Datasheet Link: https://www.mouser.it/datasheet/2/891/esp32-wrover_datasheet_en-1223875.pdf; Height: 3mm; Manufacturer_Part_Number: ESP32-WROVER; Mouser Part Number: 356-ESP32-WROVER
L?#1 = INDC_2u2_1210_1200mA: Manufacturer 1: TDK Corporation; Manufacturer Part Number 1: NLCV32T-2R2M-PFR; Ratings: 1.2 Adc; Tolerance: ±20%; Type: Ferrite Core; DC Resistance (DCR): 115 mOhm; Q @ Freq: 15 @ 7.96MHz; Frequency - Self Resonant: 68MHz; Frequency - Test: 7.96MHz; SCDType: source; Package / Case: 1210 (3225 Metric); Supplier 1: Digi-Key; Supplier Part Number 1: 445-3650-1-ND; ComponentLink1URL: http://www.tdk.co.jp/tefe02/e511_nlcv_nlc.pdf; ComponentLink1Description: http://www.tdk.co.jp/tefe02/e511_nlcv_nlc.pdf; Operating Temperature: -40°C ~ 125°C; Value: 6.8NH
L?#2 = INDC_2u2_1210_1200mA: Inductor 2.2uH 1.2A 1210 SMD chip; Manufacturer 1: TDK Corporation; Manufacturer Part Number 1: NLCV32T-2R2M-PFR; Ratings: 1.2 Adc; Tolerance: ±20%; Type: Ferrite Core; DC Resistance (DCR): 115 mOhm; Q @ Freq: 15 @ 7.96MHz; Frequency - Self Resonant: 68MHz; Frequency - Test: 7.96MHz; SCDType: source; Package / Case: 1210 (3225 Metric); Supplier 1: Digi-Key; Supplier Part Number 1: 445-3650-1-ND; ComponentLink1URL: http://www.tdk.co.jp/tefe02/e511_nlcv_nlc.pdf; ComponentLink1Description: http://www.tdk.co.jp/tefe02/e511_nlcv_nlc.pdf; Operating Temperature: -40°C ~ 125°C
L?#3 = DRC-V-822K: Radial Inductor with Leads,8200ÂµH, 0.13A,Q>20; MF: Bel Fuse; MP: DRC-V-822K; Purchase-URL: https://pricing.snapeda.com/search/part/DRC-V-822K/?ref=eda; SnapEDA_Link: https://www.snapeda.com/parts/DRC-V-822K/Bel+Fuse/view-part/?ref=snap; Value: *; Package: None; Price: None; Availability: In Stock; Check_prices: https://www.snapeda.com/parts/DRC-V-822K/Bel+Fuse/view-part/?ref=eda
MAIN_ANT? = ANT-LTE-CER-T: Cellular Multiband Monopole Ceramic Chip Antenna; MF: Linx Technologies; Value: *; Price: None; Package: None; Check_prices: https://www.snapeda.com/parts/ANT-LTE-CER-T/Linx%20Technologies%20Inc./view-part/2769557/?ref=eda; Availability: In Stock; SnapEDA_Link: https://www.snapeda.com/parts/ANT-LTE-CER-T/Linx%20Technologies%20Inc./view-part/2769557/?ref=snap; MP: ANT-LTE-CER-T
MICRO_SD? = CON_Micro SD: Secure Digital Card Socket; Max Current: mA; designer: Eng. Saeid Jorablo; Company: SJ Libraries; Connector type: Header; Mounting Technology: Surface Mount; Status: Unreleased; Category: Connector; Pin Count: 13; Publisher: SJ UnLimited; ComponentLink1Description: Datasheet; ComponentLink2Description: Reference; Update: 7/8/2012; HelpURL: http://s3.picofile.com/file/7443264187/Coming_Soon_logo.gif
P? = Header 19: Header, 19-Pin; LatestRevisionDate: 17-Jul-2002; LatestRevisionNote: Re-released for DXP Platform.; Publisher: Altium Limited
PORGRAM? POWER_SW? RESET? RESET_SW? USB_BOOT_SW? = Switch PB: Push Button Switch
Q?#1 Q?#2 Q?#10 Q?#15 Q?#17 = SMD-TRANSISTORS-NPN-25V-500MW(SOT-23): 305010017; Price: None; MP: S8050; Availability: Unavailable; Value: *; Package: None
Q?#3-Q?#6 Q?#11 Q?#16 = BSS138: N-Channel 50V 220mA (Ta) 360mW (Ta) Surface Mount SOT-23-3; Price: None; MP: BSS138; Value: *; Availability: Unavailable; Package: None
Q?#7-Q?#9 Q?#12-Q?#14 = MMBT3904: Bipolar _BJT_ Transistor NPN 40V 200mA 270MHz 350mW Surface Mount SOT-23-3; MF: STMicroelectronics; Price: None; Package: SOT-23-3 Taiwan Semiconductor; Value: *; MP: MMBT3904; Availability: Unavailable; SnapEDA_Link: https://www.snapeda.com/parts/MMBT3904/STMicroelectronics/view-part/2875870/?ref=snap
R?#1 R?#2 R?#4-R?#64 = RES Axial 0.5W: Designer: Abbas Basereh; Desc.: RES Axial 0.5W; Data: 4-1-2017
R?#3 R?#65 = RES 1206 0.25W: RES 1206; Designer: Abbas Basereh; Desc.: RES SMD 1206; Data: 16-12-2016
SIM? = SIM8051-6-0-14-00-X-REVD: Nano SIM Card Connector, Push-Pull Type, 6 Pin, SMT, Profile 1.35mm; Price: None; Value: *; MP: SIM8051-6-0-14-00-X-REVD; Package: None; Availability: Unavailable
U?#1 = LM2596S-3.3_NOPB: Integrated Circuit; Manufacturer_Name: Texas Instruments; Manufacturer_Part_Number: LM2596S-3.3/NOPB; Datasheet Link: http://www.ti.com/lit/ds/symlink/lm2596.pdf; Height: 4.65mm; Mouser Part Number: 926-LM2596S-3.3/NOPB; Mouser Price/Stock: https://www.mouser.co.uk/ProductDetail/Texas-Instruments/LM2596S-3.3-NOPB?qs=X1J7HmVL2ZHsEwG9Q6doow%3D%3D; Arrow Part Number: LM2596S-3.3/NOPB; Arrow Price/Stock: https://www.arrow.com/en/products/lm2596s-3.3nopb/texas-instruments?region=nac
U?#2 = MAX485: 1/1 Transceiver Half RS422, RS485 8-SOIC; MF: Maxim Integrated; SnapEDA_Link: https://www.snapeda.com/parts/MAX485/Maxim%20Integrated/view-part/493689/?ref=snap; Package: SOIC-8 Maxim Integrated; MP: MAX485; Value: *; Digi-Key_Part_Number: MAX485CSA+TCT-ND; Digi-Key_Purchase_URL: https://www.digikey.com/product-detail/en/maxim-integrated/MAX485CSA-T/MAX485CSA-TCT-ND/3894816?utm_source=snapeda&utm_medium=aggregator&utm_campaign=symbol
U?#3 = MIC29302WU-TR: Integrated Circuit; Manufacturer_Name: Microchip; Datasheet Link: http://ww1.microchip.com/downloads/en/DeviceDoc/20005685A.pdf; Height: 4.597mm; Manufacturer_Part_Number: MIC29302WU-TR; Mouser Part Number: 998-MIC29302WUTR; Mouser Price/Stock: https://www.mouser.co.uk/ProductDetail/Microchip-Technology/MIC29302WU-TR?qs=U6T8BxXiZAWR9%2FgJIuiMuA%3D%3D; Arrow Part Number: MIC29302WU-TR; Arrow Price/Stock: https://www.arrow.com/en/products/mic29302wu-tr/microchip-technology?region=nac
U?#4 = SM712: 31V, 19V Clamp 19A _8/20Âµs_ Ipp Tvs Diode Surface Mount SOT-23-3; MF: Semtech; Package: SOT-23 Semtech; Price: None; Value: *; MP: SM712; SnapEDA_Link: https://www.snapeda.com/parts/SM712/Semtech/view-part/4219095/?ref=snap; Availability: Unavailable
U?#5 = ESP32-C6-WROOM-1-N8: Multiprotocol Modules ESP32-C6 module, Wi-Fi 6 in 2.4 GHz band, Bluetooth 5, Zigbee 3.0 and Thread. ESP34-WROOM Compatible - ENGINEERING SAMPLE; MF: Espressif Systems; SnapEDA_Link: https://www.snapeda.com/parts/ESP32-C6-WROOM-1-N8/Espressif+Systems/view-part/?ref=snap; Package: None; Value: *; MP: ESP32-C6-WROOM-1-N8; Check_prices: https://www.snapeda.com/parts/ESP32-C6-WROOM-1-N8/Espressif+Systems/view-part/?ref=eda
U?#6 = TXS0108EPWR: 8-bit bidirectional voltage-level shifter for open-drain and push-pull application; MF: Texas Instruments; Value: *; SnapEDA_Link: https://www.snapeda.com/parts/TXS0108EPWR/Texas+Instruments/view-part/?ref=snap; Purchase-URL: https://pricing.snapeda.com/search/part/TXS0108EPWR/?ref=eda; Availability: In Stock; Price: None; Package: TSSOP-20 Texas Instruments; Check_prices: https://www.snapeda.com/parts/TXS0108EPWR/Texas+Instruments/view-part/?ref=eda; MP: TXS0108EPWR
U?#7 = CH340: CH340 USB 2.0 to UART Interface Evaluation Board; MF: DFRobot; Value: *; Price: None; Package: None; SnapEDA_Link: https://www.snapeda.com/parts/CH340/DFRobot/view-part/53354/?ref=snap; Availability: Unavailable; MP: CH340
U?#8 = EC200UCNAA-N05-SGNSA: Integrated Circuit; Manufacturer_Name: Quectel; Datasheet Link: https://www.evelta.com/content/datasheets/027-EC200UCNAA.pdf; Height: 2.6mm; Manufacturer_Part_Number: EC200UCNAA-N05-SGNSA; Mouser Part Number: 277-EC2UCNAAN05SGNSA; Mouser Price/Stock: https://www.mouser.co.uk/ProductDetail/Quectel/EC200UCNAA-N05-SGNSA?qs=vvQtp7zwQdNfIz65%252BTj4jQ%3D%3D
USB?#1 USB?#2 = USB AB MICRO CONNECTOR: USB MICRO-B Type Connector; Designer: ABBAS BASEREH; Max Current: 1600mA; Mounting Technology: Surface Mount\Through-Hole; Category: Connector; Pin Count: 5-7; Publisher: ABBAS BASEREH; Status: Unreleased; ComponentLink1Description: Datasheet; ComponentLink2Description: Reference; Update: 1395-11-17
Y? = XTAL: XTAL Crystal; Designer: ABBAS BASEREH; Design Date: 2017-1-3; ComponentLink1Description: Datasheet; ComponentLink2Description: Reference; Mounting Technology: Surface Mount\Through-Hole; Value: 12 MHz; Status: Unreleased